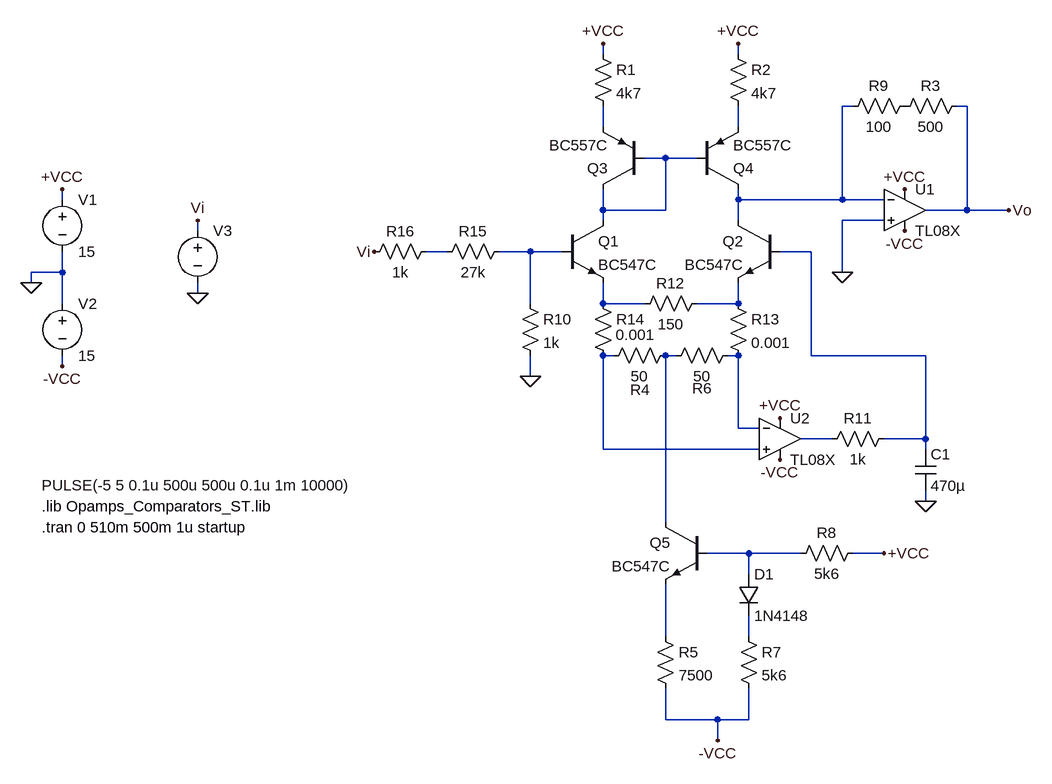
[diagram p0: schematic CrazyStuff.asc]
CrazyStuff.asc, the LTspice schematic file:
Version 4
SHEET 1 880 808
WIRE -224 -352 -224 -368
WIRE -16 -352 -16 -368
WIRE 160 -272 144 -272
WIRE 336 -272 320 -272
WIRE -224 -240 -224 -272
WIRE -16 -240 -16 -272
WIRE -128 -192 -160 -192
WIRE -80 -192 -128 -192
WIRE -1056 -128 -1056 -144
WIRE -16 -128 -16 -144
WIRE 144 -128 144 -272
WIRE 144 -128 -16 -128
WIRE 208 -128 144 -128
WIRE -224 -112 -224 -144
WIRE -128 -112 -128 -192
WIRE -128 -112 -224 -112
WIRE 336 -112 336 -272
WIRE 336 -112 272 -112
WIRE 400 -112 336 -112
WIRE -224 -96 -224 -112
WIRE -16 -96 -16 -128
WIRE 208 -96 144 -96
WIRE -848 -80 -848 -96
WIRE -464 -48 -496 -48
WIRE -336 -48 -384 -48
WIRE -288 -48 -336 -48
WIRE 96 -48 48 -48
WIRE -1056 -16 -1056 -48
WIRE -1056 -16 -1104 -16
WIRE 144 -16 144 -96
WIRE -1104 0 -1104 -16
WIRE -848 16 -848 0
WIRE -1056 32 -1056 -16
WIRE -336 32 -336 -48
WIRE -224 32 -224 0
WIRE -160 32 -224 32
WIRE -16 32 -16 0
WIRE -16 32 -80 32
WIRE -208 112 -224 112
WIRE -112 112 -128 112
WIRE -16 112 -32 112
WIRE 96 112 96 -48
WIRE 272 112 96 112
WIRE -1056 128 -1056 112
WIRE -336 144 -336 112
WIRE -16 224 -16 112
WIRE 16 224 -16 224
WIRE 128 240 80 240
WIRE 272 240 272 112
WIRE 272 240 208 240
WIRE -224 256 -224 112
WIRE 16 256 -224 256
WIRE 272 256 272 240
WIRE 272 336 272 320
WIRE -128 368 -128 112
WIRE 0 416 -64 416
WIRE 80 416 0 416
WIRE 208 416 160 416
WIRE 0 448 0 416
WIRE -128 544 -128 464
WIRE 0 544 0 512
WIRE -128 672 -128 624
WIRE -48 672 -128 672
WIRE 0 672 0 624
WIRE 0 672 -48 672
WIRE -48 704 -48 672
FLAG -1104 0 0
FLAG -1056 -144 +VCC
FLAG -1056 128 -VCC
FLAG -848 16 0
FLAG -848 -96 Vi
FLAG -16 -368 +VCC
FLAG -224 -368 +VCC
FLAG 240 -144 +VCC
FLAG 240 -80 -VCC
FLAG 144 -16 0
FLAG 400 -112 Vo
FLAG -48 704 -VCC
FLAG 208 416 +VCC
FLAG -336 144 0
FLAG 48 208 +VCC
FLAG 48 272 -VCC
FLAG 272 336 0
FLAG -576 -48 Vi
SYMBOL voltage -1056 -144 R0
WINDOW 123 0 0 Left 0
WINDOW 39 0 0 Left 0
SYMATTR InstName V1
SYMATTR Value 15
SYMBOL voltage -1056 16 R0
WINDOW 123 0 0 Left 0
WINDOW 39 0 0 Left 0
SYMATTR InstName V2
SYMATTR Value 15
SYMBOL voltage -848 -96 R0
WINDOW 3 -240 407 Left 2
WINDOW 123 0 0 Left 0
WINDOW 39 0 0 Left 0
SYMATTR Value PULSE(-5 5 0.1u 500u 500u 0.1u 1m 10000)
SYMATTR InstName V3
SYMBOL npn -288 -96 R0
SYMATTR InstName Q1
SYMATTR Value BC547C
SYMBOL npn 48 -96 M0
SYMATTR InstName Q2
SYMATTR Value BC547C
SYMBOL res -240 -368 R0
SYMATTR InstName R1
SYMATTR Value 4k7
SYMBOL res -32 -368 R0
SYMATTR InstName R2
SYMATTR Value 4k7
SYMBOL pnp -160 -144 R180
SYMATTR InstName Q3
SYMATTR Value BC557C
SYMBOL pnp -80 -144 M180
SYMATTR InstName Q4
SYMATTR Value BC557C
SYMBOL Opamps\\opamp2 240 -176 R0
SYMATTR InstName U1
SYMATTR Value TL08X
SYMBOL res 336 -288 R90
WINDOW 0 0 56 VBottom 2
WINDOW 3 32 56 VTop 2
SYMATTR InstName R3
SYMATTR Value 500
SYMBOL npn -64 368 M0
SYMATTR InstName Q5
SYMATTR Value BC547C
SYMBOL res -144 528 R0
SYMATTR InstName R5
SYMATTR Value 7500
SYMBOL res -16 528 R0
SYMATTR InstName R7
SYMATTR Value 5k6
SYMBOL res 176 400 R90
WINDOW 0 0 56 VBottom 2
WINDOW 3 32 56 VTop 2
SYMATTR InstName R8
SYMATTR Value 5k6
SYMBOL diode -16 448 R0
SYMATTR InstName D1
SYMATTR Value 1N4148
SYMBOL res -112 96 R90
WINDOW 0 84 55 VBottom 2
WINDOW 3 32 56 VTop 2
SYMATTR InstName R4
SYMATTR Value 50
SYMBOL res -16 96 R90
WINDOW 0 82 56 VBottom 2
WINDOW 3 32 56 VTop 2
SYMATTR InstName R6
SYMATTR Value 50
SYMBOL res 256 -288 R90
WINDOW 0 0 56 VBottom 2
WINDOW 3 32 56 VTop 2
SYMATTR InstName R9
SYMATTR Value 100
SYMBOL res -352 16 R0
SYMATTR InstName R10
SYMATTR Value 1k
SYMBOL res 112 256 R270
WINDOW 0 32 56 VTop 2
WINDOW 3 0 56 VBottom 2
SYMATTR InstName R11
SYMATTR Value 1k
SYMBOL Opamps\\opamp2 48 176 R0
SYMATTR InstName U2
SYMATTR Value TL08X
SYMBOL cap 256 256 R0
SYMATTR InstName C1
SYMATTR Value 470µ
SYMBOL res -64 16 R90
WINDOW 0 0 56 VBottom 2
WINDOW 3 32 56 VTop 2
SYMATTR InstName R12
SYMATTR Value 150
SYMBOL res -32 16 R0
SYMATTR InstName R13
SYMATTR Value 0.001
SYMBOL res -240 16 R0
WINDOW 3 35 64 Left 2
SYMATTR InstName R14
SYMATTR Value 0.001
SYMBOL res -368 -64 R90
WINDOW 0 0 56 VBottom 2
WINDOW 3 32 56 VTop 2
SYMATTR InstName R15
SYMATTR Value 27k
SYMBOL res -480 -64 R90
WINDOW 0 0 56 VBottom 2
WINDOW 3 32 56 VTop 2
SYMATTR InstName R16
SYMATTR Value 1k
TEXT -1088 376 Left 2 !.tran 0 510m 500m 1u startup
TEXT -1088 344 Left 2 !.lib Opamps_Comparators_ST.lib

The netlist it stands for:
* CrazyStuff.asc
V1 +VCC 0 15
V2 0 -VCC 15
V3 Vi 0 PULSE(-5 5 0.1u 500u 500u 0.1u 1m 10000)
Q1 N004 N006 N008 0 BC547C
Q2 N001 N007 N009 0 BC547C
R1 +VCC N002 4k7
R2 +VCC N003 4k7
Q3 N004 N004 N002 0 BC557C
Q4 N001 N004 N003 0 BC557C
XU1 0 N001 +VCC -VCC Vo TL08X  ; pins In+ In- V+ V- OUT
R3 Vo P001 500
Q5 N011 N014 N015 0 BC547C
R5 N015 -VCC 7500
R7 N016 -VCC 5k6
R8 +VCC N014 5k6
D1 N014 N016 1N4148
R4 N011 N010 50
R6 N012 N011 50
R9 P001 N001 100
R10 N006 0 1k
R11 N013 N007 1k
XU2 N010 N012 +VCC -VCC N013 TL08X  ; pins In+ In- V+ V- OUT
C1 N007 0 470µ
R12 N009 N008 150
R13 N009 N012 0.001
R14 N008 N010 0.001
R15 N006 N005 27k
R16 N005 Vi 1k
.model D D
.lib standard.dio
.model NPN NPN
.model PNP PNP
.lib standard.bjt
.tran 0 510m 500m 1u startup
.lib Opamps_Comparators_ST.lib
.backanno
.end

* Results of the author's LTspice run, read from the files saved beside the schematic
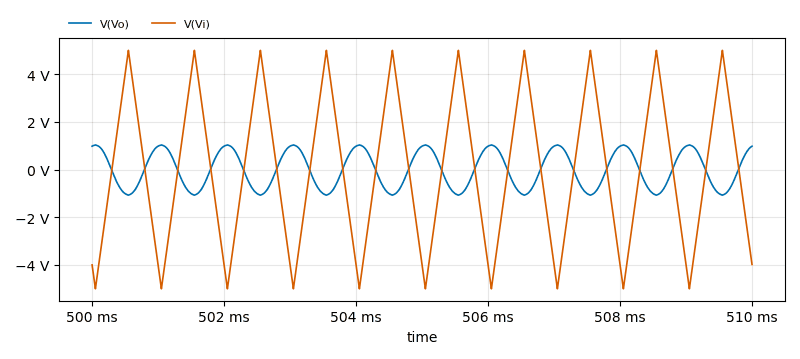
[diagram p1: Transient Analysis of CrazyStuff.asc, plotted from the saved traces]
* Transient Analysis, 1 run:
*   V(Vo): min -1.071 V, max 1.032 V, average -6.122 mV, rms 746.4 mV, last 981.1 mV
*   V(Vi): min -5 V, max 5 V, average 898.8 µV, rms 2.893 V, last -3.978 V